# Altium schematic sheet INA220.SchDoc
size A4; Organization1: VINCULADA AO EXÉRCITO BRASILEIRO; Organization2: FÁBRICA DE MATERIAL DE; Organization3: COMUNICAÇÕES E ELETRÔNICA; Organization0: INDÚSTRIA DE MATERIAL BÉLICO DO BRASIL
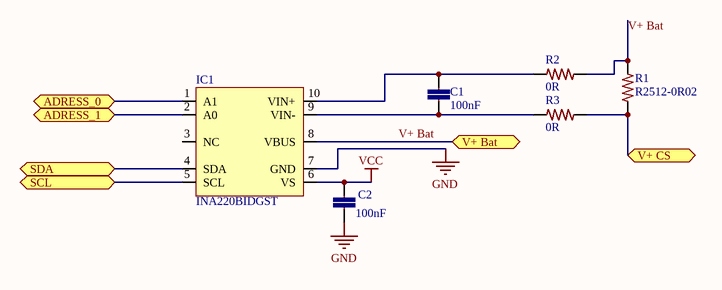
[diagram p0: INA220.SchDoc]

## Parts
C1  100nF  [0402-CAP]
C2  100nF  [0402-CAP]
IC1  INA220BIDGST  [TSSOP10]
R1  R2512-0R02  [2512-RES-HD]
R2  0R  [0402-RES-HD]
R3  0R  [0402-RES-HD]

## Ports
ADRESS_0, ADRESS_1, SCL, SDA, V+ Bat, V+ CS

## Nets
GND: C2.2 IC1.7(GND)
VCC: C2.1 IC1.6(VS)
ADRESS_0: IC1.1(A1) ; port ADRESS_0
ADRESS_1: IC1.2(A0) ; port ADRESS_1
SCL: IC1.5(SCL) ; port SCL
SDA: IC1.4(SDA) ; port SDA
V+ Bat: IC1.8(VBUS) R1.2 R2.2 ; port V+ Bat
V+ CS: R1.1 R3.2 ; port V+ CS
NetC1_1: C1.1 IC1.10(VIN+) R2.1
NetC1_2: C1.2 IC1.9(VIN-) R3.1

Not connected (* = marked no-connect by the designer): IC1 3(NC)

## Notes on the sheet
- USADO EQUIP.:
- DATA:
- ENG:
- HORA:
- APROV._______
- REV:
- TÍTULO:
- FOLHA:
- /
- FORMATO:
- A4
- CÓDIGO:
- ESTOQUE:

## Library data of the parts
C1 C2 = CC0402-100nF-A.12: CAP CER 0.1UF 10V 20% X5R 0402; Part No: VJ0402V104ZXQPBC; Cod EMS: 05.281.006.133; Value: 100n
IC1 = INA220BIDGST-3: IC MONITOR PWR/CURR BIDIR 10MSOP; Cod EMS: 05.284.001.527; Part No: INA220BIDGST
R1 = R2512-0R02-4: RES .02 OHM 2W 1% 2512 SMD; Part No: WSL2512R0200FEA18; Cod EMS: 05.280.029.529; Value: 0.02; Family Description: RESISTOR SENTIDO DE CORRENTE 0,010R-0,040R/ 2W / 1% / 2512 P/N: WSL2512.....FEA18 – VISHAY DALE.; Family: WSL2512.....FEA18
R2 R3 = R0402-0R-7: RES 0.0 OHM 1/16W JUMP 0402 SMD; Part No: CRCW04020000Z0ED; Cod EMS: 05.280.029.528; Value: 0